# Altium schematic sheet schematic.SchDoc
size B
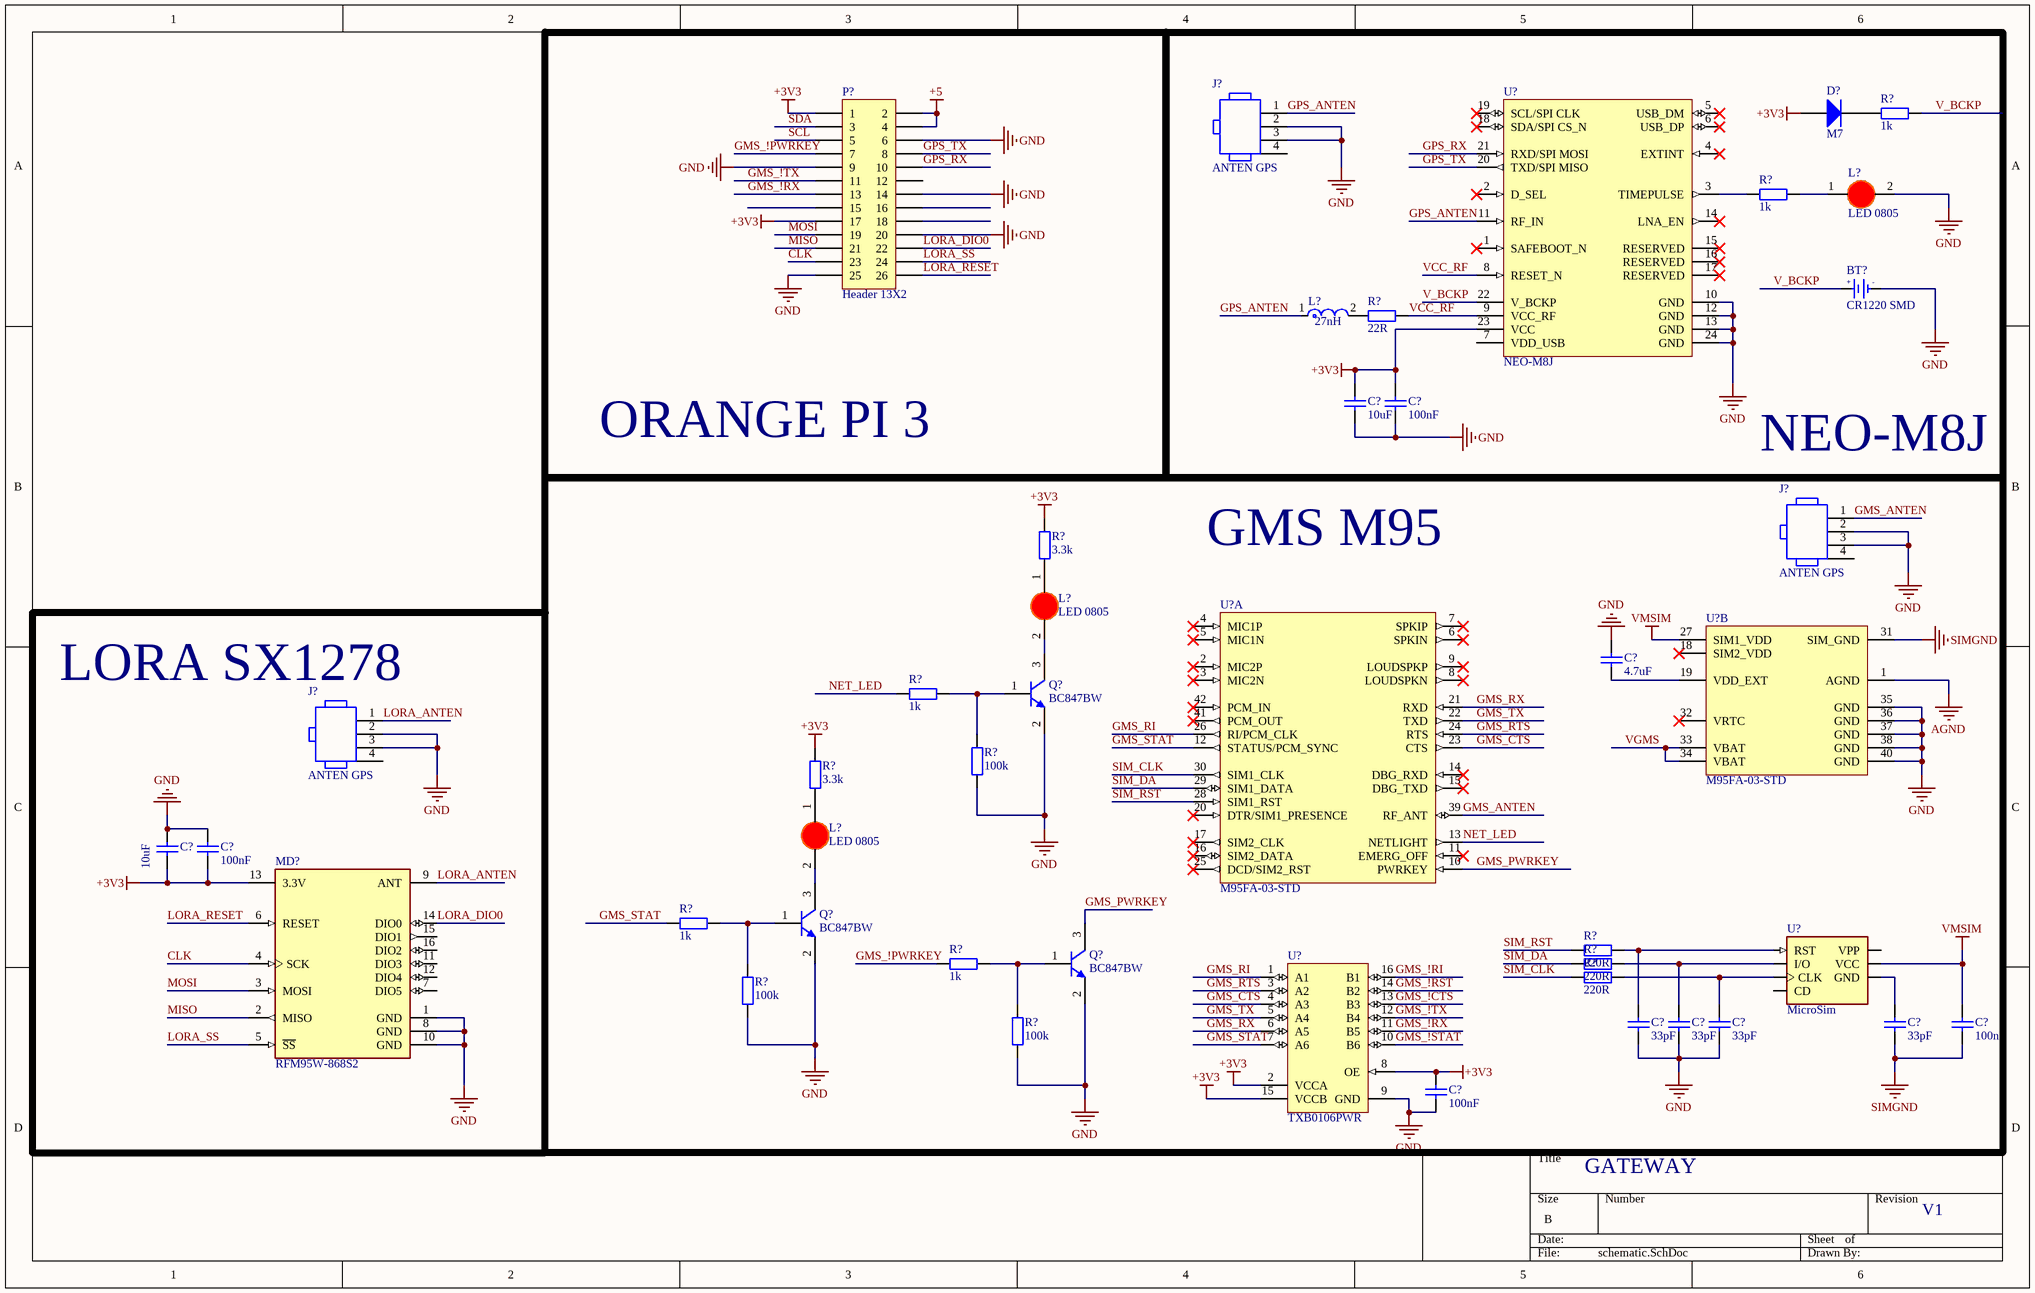
[diagram p0: schematic.SchDoc]

## Parts
(Parts that share a designator on the sheet are numbered #1, #2 ... from top to bottom, then left to right.)
BT?  CR1220 SMD  [DE PIN CR1220]
C?#1  10uF  [tu 0603]
C?#2  100nF  [tu 0603]
C?#3  4.7uF  [tu 0603]
C?#4  10uF  [tu 0603]
C?#5  100nF  [tu 0603]
C?#6  33pF  [tu 0603]
C?#7  33pF  [tu 0603]
C?#8  33pF  [tu 0603]
C?#9  33pF  [tu 0603]
C?#10  100nF  [tu 0603]
C?#11  100nF  [tu 0603]
D?  M7  [DIODE SMA]
J?#1  ANTEN GPS  [TG-RECE-20369-001E-4_V]
J?#2  ANTEN GPS  [TG-RECE-20369-001E-4_V]
J?#3  ANTEN GPS  [TG-RECE-20369-001E-4_V]
L?#1  LED 0805  [LED-0805-Red]
L?#2  27nH  [FP-LQG18HH_00-MFG]
L?#3  LED 0805  [LED-0805-Red]
L?#4  LED 0805  [LED-0805-Red]
MD?  RFM95W-868S2  [FP-RFM95W-868S2-MFG]
P?  Header 13X2  [HDR2X13]
Q?#1  BC847BW  [INF-SOT323_N]
Q?#2  BC847BW  [INF-SOT323_N]
Q?#3  BC847BW  [INF-SOT323_N]
R?#1  1k  [tro smd 0603]
R?#2  1k  [tro smd 0603]
R?#3  22R  [tro smd 0603]
R?#4  3.3k  [tro smd 0603]
R?#5  1k  [tro smd 0603]
R?#6  100k  [tro smd 0603]
R?#7  3.3k  [tro smd 0603]
R?#8  1k  [tro smd 0603]
R?#9  220R  [tro smd 0603]
R?#10  1k  [tro smd 0603]
R?#11  220R  [tro smd 0603]
R?#12  220R  [tro smd 0603]
R?#13  100k  [tro smd 0603]
R?#14  100k  [tro smd 0603]
U?#1  NEO-M8J  [UBX-NEO-M8-24_V]
U?#2  M95FA-03-STD  [QUEC-M95FA-03-STD_V]  (part A of 2)
U?#3  M95FA-03-STD  [QUEC-M95FA-03-STD_V]  (part B of 2)
U?#4  TXB0106PWR  [PW0016A_L]
U?#5  MicroSim  [Micro-Sim-7P]

## Blocks framed on the sheet
ORANGE PI 3: P?
NEO-M8J: BT? C?#1 C?#2 D? J?#1 L?#1 L?#2 R?#1-R?#3 U?#1
GMS M95: C?#3 C?#6-C?#11 J?#2 L?#3 L?#4 Q?#1-Q?#3 R?#4-R?#14 U?#2-U?#5
LORA SX1278: C?#4 C?#5 J?#3 MD?

## Nets
+3V3: C?#1.2 C?#2.1 C?#4.2 C?#5.2 C?#11.1 D?.1(A) MD?.13(3.3V) P?.1 P?.17 R?#4.2 R?#7.2 U?#1.23(VCC) U?#4.2(VCCA) U?#4.8(OE) U?#4.15(VCCB)
+5: P?.2 P?.4
AGND: U?#3.1(AGND)
GND: BT?.2(GND) C?#1.1 C?#2.2 C?#3.1 C?#4.1 C?#5.1 C?#6.2 C?#7.2 C?#8.2 C?#11.2 J?#1.2 J?#1.3 J?#2.2 J?#2.3 J?#3.2 J?#3.3 L?#1.2(K) MD?.1(GND) MD?.8(GND) MD?.10(GND) P?.6 P?.9 P?.14 P?.20 P?.25 Q?#1.2(E) Q?#2.2(E) Q?#3.2(E) R?#6.1 R?#13.1 R?#14.1 U?#1.10(GND) U?#1.12(GND) U?#1.13(GND) U?#1.24(GND) U?#3.35(GND) U?#3.36(GND) U?#3.37(GND) U?#3.38(GND) U?#3.40(GND) U?#4.9(GND)
SIMGND: C?#9.2 C?#10.2 U?#3.31(SIM_GND)
VMSIM: C?#10.1 U?#3.27(SIM1_VDD) U?#5.C1(VCC)
CLK: MD?.4(SCK) P?.23
GMS_!CTS: U?#4.13(B3)
GMS_!PWRKEY: P?.7 R?#10.1
GMS_!RI: U?#4.16(B1)
GMS_!RST: U?#4.14(B2)
GMS_!RX: P?.13 U?#4.11(B5)
GMS_!STAT: U?#4.10(B6)
GMS_!TX: P?.11 U?#4.12(B4)
GMS_ANTEN: J?#2.1 U?#2.39(RF_ANT)
GMS_CTS: U?#2.23(CTS) U?#4.4(A3)
GMS_PWRKEY: Q?#3.3(C) U?#2.10(PWRKEY)
GMS_RI: U?#2.26(RI/PCM_CLK) U?#4.1(A1)
GMS_RTS: U?#2.24(RTS) U?#4.3(A2)
GMS_RX: U?#2.21(RXD) U?#4.6(A5)
GMS_STAT: R?#8.1 U?#2.12(STATUS/PCM_SYNC) U?#4.7(A6)
GMS_TX: U?#2.22(TXD) U?#4.5(A4)
GPS_ANTEN: J?#1.1 L?#2.1 U?#1.11(RF_IN)
GPS_RX: P?.10 U?#1.21(RXD/SPI_MOSI)
GPS_TX: P?.8 U?#1.20(TXD/SPI_MISO)
LORA_ANTEN: J?#3.1 MD?.9(ANT)
LORA_DIO0: MD?.14(DIO0) P?.22
LORA_RESET: MD?.6(RESET) P?.26
LORA_SS: MD?.5(~{SS}) P?.24
MISO: MD?.2(MISO) P?.21
MOSI: MD?.3(MOSI) P?.19
NET_LED: R?#5.1 U?#2.13(NETLIGHT)
SCL: P?.5
SDA: P?.3
SIM_CLK: R?#12.2 U?#2.30(SIM1_CLK)
SIM_DA: R?#11.2 U?#2.29(SIM1_DATA)
SIM_RST: R?#9.1 U?#2.28(SIM1_RST)
V_BCKP: BT?.1(+3V) R?#1.2 U?#1.22(V_BCKP)
VCC_RF: R?#3.2 U?#1.8(RESET_N) U?#1.9(VCC_RF)
VGMS: U?#3.33(VBAT) U?#3.34(VBAT)
NetC?#3_2: C?#3.2 U?#3.19(VDD_EXT)
NetC?#6_1: C?#6.1 R?#9.2 U?#5.C2(RST)
NetC?#7_1: C?#7.1 R?#11.1 U?#5.C7(I/O)
NetC?#8_1: C?#8.1 R?#12.1 U?#5.C3(CLK)
NetC?#9_1: C?#9.1 U?#5.C5(GND)
NetD?_2: D?.2(K) R?#1.1
NetL?#1_1: L?#1.1(A) R?#2.2
NetL?#2_2: L?#2.2 R?#3.1
NetL?#3_1: L?#3.1(A) R?#4.1
NetL?#3_2: L?#3.2(K) Q?#1.3(C)
NetL?#4_1: L?#4.1(A) R?#7.1
NetL?#4_2: L?#4.2(K) Q?#2.3(C)
NetQ?#1_1: Q?#1.1(B) R?#5.2 R?#6.2
NetQ?#2_1: Q?#2.1(B) R?#8.2 R?#13.2
NetQ?#3_1: Q?#3.1(B) R?#10.2 R?#14.2
NetR?#2_1: R?#2.1 U?#1.3(TIMEPULSE)

Not connected (* = marked no-connect by the designer): J?#1 4; J?#2 4; J?#3 4; MD? 7(DIO5) 11(DIO3) 12(DIO4) 15(DIO1) 16(DIO2); P? 12 15 16 18; U?#1 1(SAFEBOOT_N)* 2(D_SEL)* 4(EXTINT)* 5(USB_DM)* 6(USB_DP)* 7(VDD_USB) 14(LNA_EN)* 15(RESERVED)* 16(RESERVED)* 17(RESERVED)* 18(SDA/SPI_CS_N)* 19(SCL/SPI_CLK)*; U?#2 2(MIC2P)* 3(MIC2N)* 4(MIC1P)* 5(MIC1N)* 6(SPKIN)* 7(SPKIP)* 8(LOUDSPKN)* 9(LOUDSPKP)* 11(EMERG_OFF)* 14(DBG_RXD)* 15(DBG_TXD)* 16(SIM2_DATA)* 17(SIM2_CLK)* 20(DTR/SIM1_PRESENCE)* 25(DCD/SIM2_RST)* 41(PCM_OUT)* 42(PCM_IN)*; U?#3 18(SIM2_VDD)* 32(VRTC)*; U?#5 C6(VPP) CD

## Notes on the sheet
- GATEWAY
- V1
- (in symbol De pin CR1220 SMD) +; -

## Library data of the parts
BT? = De pin CR1220 SMD: Ten: Đế PIN CR1220 SMD; Ma_Hang: MH000833
C?#1 C?#4 C?#10 C?#11 = Tu 0603 105 16V 20%: Dán; Don_Vi: Con; So_Chan: 2; Ten_Linh_Kien: Tụ 0603 105-1uF 20% 16V; Ma_Hang: MH004574; Chung_Loai: Dán; Kieu_Chan: *
C?#2 C?#5-C?#9 = Tu 0603 104 50V 10%: Dán; Don_Vi: Con; So_Chan: 2; Ten_Linh_Kien: Tụ 0603 104-100nF 10% 50V; Ma_Hang: MH004568; Chung_Loai: Dán; Kieu_Chan: *
C?#3 = Tu 0603 105 50V 10%: Dán; Don_Vi: Con; So_Chan: 2; Ten_Linh_Kien: Tụ 0603 105-1uF 50V 10%; Ma_Hang: MH004569; Chung_Loai: Dán; Kieu_Chan: *
D? = Diode M7 ( 4007 ): Dán; Don_Vi: Con; Ten_Linh_Kien: Diode M7 1N4007 SMD 1A 1000V; Ma_Hang: MH000944; Chung_Loai: Dán; Ghi_Chu: *
J?#1-J?#3 = CMP-0275-00001-2: RF Connector, Onboard Receptacle, IPEX MHFIII; Manufacturer: Taoglas; PartNumber: RECE-20369-001E-01; Packing: Tape and Reel; Mounting Technology: Surface Mount; PackageReference: RECE-20369-001E-01-4; ComponentLink1URL: http://www.taoglas.com/; Housing Color: Gold; DatasheetVersion: Rev. C; ComponentLink2URL: http://www.taoglas.com/images/product_images/original_images/RECE.20369.001E.01.pdf; ComponentLink3Description: Package Specification; PackageVersion: Rev. C; ComponentLink1Description: Manufacturer URL; ComponentLink2Description: Datasheet; PackageDescription: 4-Pin, Hand Drawn, Body 1.7x1.7mm; ComponentLink3URL: http://www.taoglas.com/images/product_images/original_images/RECE.20369.001E.01.pdf
L?#1 L?#3 L?#4 = LED 0805 Do: Dán; Don_Vi: Con; Ma_Hang: MH000897; Ten_Linh_Kien: LED 0805 Màu Đỏ (Red); Ghi_Chu: *; Kieu_Chan: *; Chung_Loai: Dán
L?#2 = CMP-06042-005497-1: Multilayer type RF Inductor 27nH ±5% 0.54Ω 500mA 0603; Q Factor: 12; Shielding: Unshielded; Max DC Current: 300mA; Self Resonant Frequency: 2GHz; Test Frequency: 100MHz; Core Material: Air; DC Resistance (DCR): 550mR; Min Operating Temperature: -55°C; Max Operating Temperature: 85°C; Tolerance: 5%; Depth: 0.95mm; Case Code (Imperial): 0603; Package Quantity: 4000; Lead Free: Lead Free; Height: 0.8mm; Radiation Hardening: No; Case/Package: 0603; Mount: Surface Mount; DC Current: 300mA; Length: 0.063inch; Inductance Tolerance: 5%; Military Standard: Not; Termination: SMD/SMT; Packaging: Tape and Reel; Current Rating: 300mA; Inductance: 27nH; Case Code (Metric): 1608; Width: 0.8mm; REACH SVHC: No SVHC; Height - Seated (Max): 0.037inch
MD? = CMP-204316-000001-1: RX TXRX MODULE ISM < 1GHZ SMD; Data Rate: 300Kbps; Frequency: 868MHz; Sensitivity: -123dBm; Interface: SPI; Current - Transmitting: 120mA; Current - Receiving: 12.1mA; Max Operating Temperature: 70°C; Case/Package: SMD/SMT; Packaging: Bulk; Mount: Surface Mount; Min Operating Temperature: -20°C
P? = Header 13X2: Header, 13-Pin, Dual row; LatestRevisionDate: 17-Jul-2002; LatestRevisionNote: Re-released for DXP Platform.; Publisher: Altium Limited
Q?#1-Q?#3 = CMP-1177-00080-1: NPN Silicon AF Transistor, 45 V VCEO, 100 mA IC, SOT323, Reel, Green; Manufacturer: Infineon; VCEO (max): 45Â V; ICBO (max): 15Â nA; IBM (max): 200Â mA; Ptot (max): 250Â mW; Green: TRUE; VEBO (max): 6Â V; IC (max): 100Â mA; VCBO (max): 50Â V; fT (typ): 250Â MHz; Halogen-free: TRUE; Packing: Reel; Mounting Technology: Surface Mount; PackageReference: SOT323; PartNumber: BC847BW; PackageDescription: 3-Pin Small Outline Transistor Package, 1.25 x 2 mm Body, 0.65 mm Pitch; ICM (max): 200Â mA; ComponentLink3Description: Package Specification; ComponentLink1URL: http://www.infineon.com/; ComponentLink2Description: Datasheet; Polarity: NPN; ComponentLink2URL: http://www.infineon.com/dgdl/bc847series_bc848series_bc849series_bc850series.pdf?folderId=db3a304314dca389011541d30fa21656&fileId=db3a304314dca389011541d4630a1657; ComponentLink1Description: Manufacturer URL; ComponentLink3URL: http://www.infineon.com/dgdl/SOT323-Package_Overview.pdf?folderId=db3a30431936bc4b0119533e1dcb3c92&fileId=db3a30431936bc4b011953495f283cb1
R?#1 R?#2 R?#4 R?#5 R?#7 R?#8 R?#10 = Tro 0603 5% 1k: Dán; Don_Vi: Con; So_Chan: 2; Ten_Linh_Kien: Trở 0603 5% 1k; Ma_Hang: MH006319; Chung_Loai: Dán; Kieu_Chan: *
R?#3 = Tro 0603 1% 1R: Dán; Don_Vi: Con; So_Chan: 2; Ten_Linh_Kien: Trở 0603 1% 1R; Ma_Hang: MH007007; Chung_Loai: Dán; Kieu_Chan: *
R?#6 R?#13 R?#14 = Tro 0603 5% 100k: Dán; So_Chan: 2; Ten_Linh_Kien: Trở 0603 5% 100k; Ma_Hang: MH006314; Don_Vi: Con; Chung_Loai: Dán; Kieu_Chan: *
R?#9 R?#11 R?#12 = Tro 0603 5% 220R: Dán; Don_Vi: Con; So_Chan: 2; Ten_Linh_Kien: Trở 0603 5% 220R; Ma_Hang: MH006322; Chung_Loai: Dán; Kieu_Chan: *
U?#1 = CMP-2000-07559-1: U-Blox M8 Concurrent Gnss Module, 3.6 V, -40 to 85 degC, 24-Pin SMD, RoHS, Tape and Reel; Mounting Technology: SurfaceMount; Manufacturer: U-Blox; Manufacturer URL: https://www.u-blox.com/en; Package Reference: NEO-M8N-0; Datasheet Version: Rev. R03, 08/2016; RoHSCompliant: False; Package URL: https://www.u-blox.com/sites/default/files/NEO-8Q-NEO-M8-FW3_HardwareIntegrationManual_%28UBX-15029985%29.pdf; Datasheet URL: https://www.u-blox.com/sites/default/files/NEO-M8-FW3_DataSheet_%28UBX-15031086%29.pdf; Package Description: 24-Pin Surface Mount Device, Body 16 x 12.2 mm, Pitch 1.1 mm
U?#2 U?#3 = CMP-2000-06650-1: Quad-Band GSM / GPRS Module, 850 / 900 / 1800 / 1900 MHz, 3.3 to 4.6 V, -40 to 85 degC, 42-Pin SMD, RoHS, Tape and Reel; Manufacturer: QUECTELWIRELESSSOLUTIONS; Manufacturer URL: http://www.quectel.com/; Datasheet Version: Rev. 3.1, 11/2014; Package Reference: M95FA-03-STD; Package Description: 42-Pin Sourface Mount Device, Body 23.6 x 19.9 mm; Package: 42LCC; Category: RFModulesMisc; Mounting Technology: SurfaceMount; Operating Temperature: -40to85°C; Datasheet URL: https://www.codico.com/shop/media/datasheets/Quectel_M95_Hardware_Design_V3.1.pdf
U?#4 = CMP-2000-07336-1: 6-Bit Bidirectional Level-Shifting and Voltage Translator with Auto-Direction Sensing and +/- 15-kV ESD Protection, 1.2 to 3.6 V, -40 to 85 degC, 16-Pin TSSOP (PW), Green (RoHS & no Sb/Br), Tape and Reel; Manufacturer: Texas Instruments; Dynamic Catalog: TXBSeries; Differential - Input: Output:No/No; Number of Bits: 6; Output Type: Logic; Propagation Delay (Max): 4ns; Number of Outputs/Channel: 1; Voltage - Supply: 1.2V~3.6V,1.65V~5.5V; Data Rate: 100Mbps; Product Training Modules: VoltageLevelTranslation; Other Names: 296-23759-1; Logic Function: Translator,Bidirectional; Packaging: CutTape(CT); Datasheet URL: http://www.ti.com/general/docs/lit/getliterature.tsp?genericPartNumber=TXB0106&fileType=pdf; Package Description: 16-Pin Small Outline Package Integrated Circuit, Body 5 x 4.4 mm, Pitch 0.65 mm; Standard Package: 1; Series: -; Manufacturer URL: http://www.ti.com/; Operating Temperature: -40°C~85°C; Supplier Device Package: 16-TSSOP; Package Reference: PW16; Number of Channels: 6; Category: IntegratedCircuits(ICs); Package / Case: 16-TSSOP(0.173",4.40mmWidth); Family: Logic-Translators; Datasheet Version: Rev. B, 06/2015; Mounting Technology: SurfaceMount; Input Type: Logic
U?#5 = Micro_Sim_7Pin: MS-PP-7P Khay Cắm Micro Sim 7 Chân Push-Push; Manufacturer: Samsung; Part number: C0805; Cost: 200; ComponentLink1Description: Link product; ComponentLink1URL: https://www.thegioiic.com/tu-gom-0805-1-5nf-50v; Package: 0805